# Altium schematic sheet MB1199.SchDoc: MB1199
size A4; Date: 01-DEC-2013; CompanyName: STMicroelectronics; Organization: Microcontrollers Division; Address1: 12, Rue Jules HOROWITZ; Address2: 38019 Grenoble; Address3: FRANCE; DocumentNumber: 2; Revision: A-01; SheetNumber: 2; SheetTotal: 2; Project: Detection Accessory
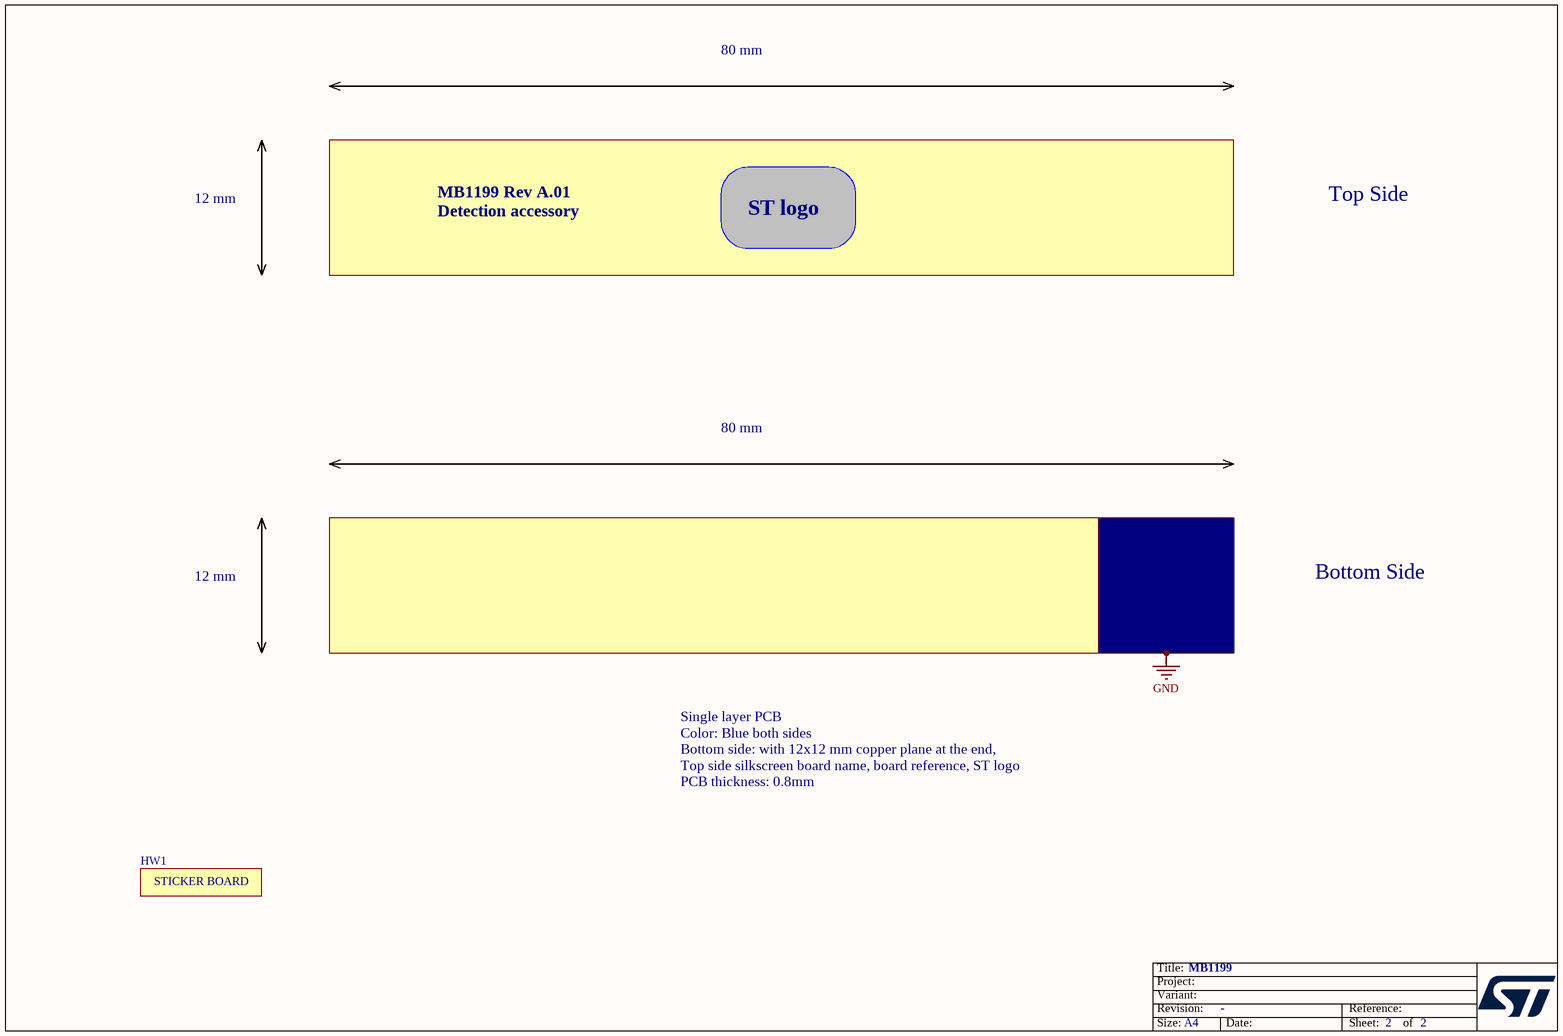
[diagram p0: MB1199.SchDoc]

## Parts
HW1  STICKER_BOARD  (value not drawn)  (no BOM)

## Notes on the sheet
- 80 mm
- 12 mm
- ST logo
- Top Side
- MB1199 Rev A.01
  Detection accessory
- Bottom Side
- Single layer PCB
  Color: Blue both sides
  Bottom side: with 12x12 mm copper plane at the end,
  Top side silkscreen board name, board reference, ST logo
  PCB thickness: 0.8mm
- Title:
- Project:
- Size:
- Revision:
- Variant:
- A4
- -
- Date:
- Reference:
- Sheet:
- of
- (in symbol STICKER_BOARD) STICKER BOARD